# EAGLE schematic untitled (EAGLE 9.6.2)
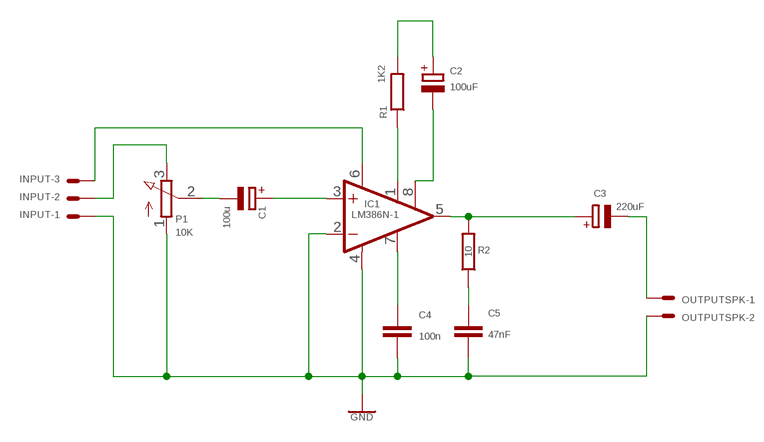
[diagram p0: schematic, sheet 1]

## Parts
C1  100u  CPOL-EUE2.5-7  [E2,5-7]
C2  100uF  CPOL-EUE2.5-7  [E2,5-7]
C3  220uF  CPOL-EUE2.5-7  [E2,5-7]
C4  100n  C-EU025-025X050  [C025-025X050]
C5  47nF  C-EU025-025X050  [C025-025X050]
IC1  LM386N-1  [DIL08]
INPUT  22-23-2031  [22-23-2031]
OUTPUTSPK  -  22-23-2021  [22-23-2021]
P1  10K  3RP/1610N  [3RP/1610N]
R1  1K2  R-EU_0207/7  [0207/7]
R2  10  R-EU_0207/7  [0207/7]

## Nets
GND: C4.2 C5.2 IC1.2(-IN) IC1.4(GND) INPUT.1 OUTPUTSPK.2 P1.1(A)
N$1: C2.- IC1.8(GAIN)
N$2: IC1.1(GAIN) R1.1
N$3: C2.+ R1.2
N$4: C4.1 IC1.7(BYPASS)
N$5: C1.+ IC1.3(+IN)
N$6: C3.+ IC1.5(OUT) R2.2
N$7: C5.1 R2.1
N$8: C3.- OUTPUTSPK.1
N$9: C1.- P1.2(S)
N$10: IC1.6(VS) INPUT.3
N$12: INPUT.2 P1.3(E)

## Library data of the parts
C1-C3 = rcl:CPOL-EU: POLARIZED CAPACITOR, European symbol; SPICEPREFIX: C
C4 C5 = rcl:C-EU: CAPACITOR, European symbol; SPICEPREFIX: C
IC1 = linear:LM386?-*: Low Voltage Audio Power Amplifier Source: http://cache.national.com/ds/LM/LM386.pdf
INPUT = con-molex:22-23-2031: .100" (2.54mm) Center Header - 3 Pin; MF: MOLEX; MPN: 22-23-2031; OC_FARNELL: 1462950; OC_NEWARK: 30C0862
OUTPUTSPK = con-molex:22-23-2021: .100" (2.54mm) Center Header - 2 Pin; MF: MOLEX; MPN: 22-23-2021; OC_FARNELL: 1462926; OC_NEWARK: 25C3832
P1 = pot:3RP/1610N: 16mm Potentiometer one level Source: http://www.alphapotentiometers.net/html/16mm_pot_2.html
R1 R2 = rcl:R-EU_: RESISTOR, European symbol; SPICEPREFIX: R